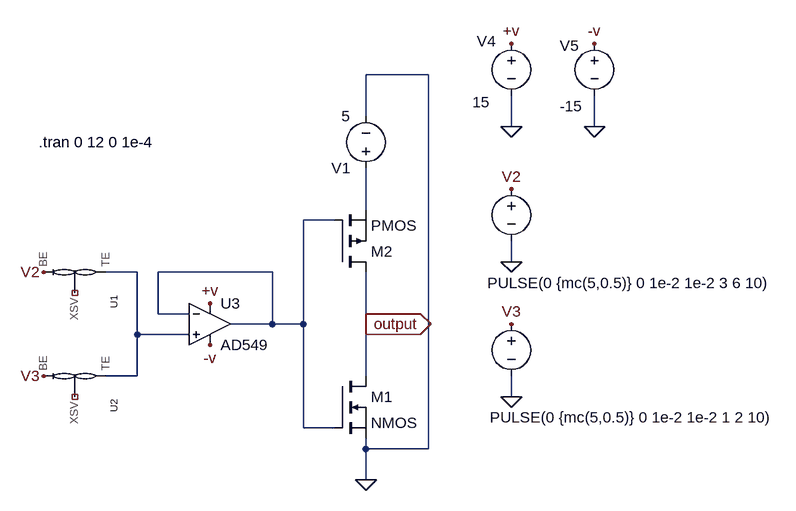
[diagram p0: schematic 与非门.asc]
与非门.asc, the LTspice schematic file:
Version 4
SHEET 1 1012 680
WIRE 448 -336 352 -336
WIRE 352 -272 352 -336
WIRE 576 -256 576 -304
WIRE 704 -256 704 -304
WIRE 352 -128 352 -192
WIRE 304 -112 256 -112
WIRE 576 -48 576 -80
WIRE 0 -32 -48 -32
WIRE 208 -32 32 -32
WIRE 32 32 32 -32
WIRE 80 32 32 32
WIRE 208 48 208 -32
WIRE 208 48 144 48
WIRE 256 48 256 -112
WIRE 256 48 208 48
WIRE 352 48 352 -32
WIRE 0 64 0 -32
WIRE 80 64 0 64
WIRE 0 128 0 64
WIRE 0 128 -48 128
WIRE 352 128 352 48
WIRE 576 160 576 128
WIRE 256 208 256 48
WIRE 304 208 256 208
WIRE 352 240 352 224
WIRE 448 240 448 -336
WIRE 448 240 352 240
WIRE 352 288 352 240
FLAG 576 -48 0
FLAG 352 288 0
FLAG 576 -256 0
FLAG 704 -256 0
FLAG 576 -384 +v
FLAG 704 -384 -v
FLAG 112 16 +v
FLAG 112 80 -v
FLAG 576 -160 V2
FLAG 576 48 V3
FLAG 576 160 0
FLAG -144 -32 V2
FLAG -144 128 V3
FLAG 352 48 output
IOPIN 352 48 Out
SYMBOL voltage 576 -176 R0
WINDOW 0 37 116 Invisible 2
WINDOW 3 183 176 Bottom 2
WINDOW 123 0 0 Left 0
WINDOW 39 0 0 Left 0
SYMATTR InstName V2
SYMATTR Value PULSE(0 {mc(5,0.5)} 0 1e-2 1e-2 3 6 10)
SYMBOL nmos 304 128 R0
SYMATTR InstName M1
SYMBOL pmos 304 -32 M180
SYMATTR InstName M2
SYMBOL voltage 352 -176 R180
WINDOW 123 0 0 Left 0
WINDOW 39 0 0 Left 0
SYMATTR InstName V1
SYMATTR Value 5
SYMBOL MEM_YAKOPCIC -96 -32 R90
SYMATTR InstName U1
SYMBOL MEM_YAKOPCIC -96 128 R90
SYMATTR InstName U2
SYMBOL OpAmps\\AD549 112 -16 R0
SYMATTR InstName U3
SYMBOL voltage 576 -400 R0
WINDOW 0 -53 12 Left 2
WINDOW 3 -60 106 Left 2
WINDOW 123 0 0 Left 0
WINDOW 39 0 0 Left 0
SYMATTR InstName V4
SYMATTR Value 15
SYMBOL voltage 704 -400 R0
WINDOW 0 -53 19 Left 2
WINDOW 3 -53 112 Left 2
WINDOW 123 0 0 Left 0
WINDOW 39 0 0 Left 0
SYMATTR InstName V5
SYMATTR Value -15
SYMBOL voltage 576 32 R0
WINDOW 0 37 116 Invisible 2
WINDOW 3 187 175 Bottom 2
WINDOW 123 0 0 Left 0
WINDOW 39 0 0 Left 0
SYMATTR InstName V6
SYMATTR Value PULSE(0 {mc(5,0.5)} 0 1e-2 1e-2 1 2 10)
TEXT -152 -232 Left 2 !.tran 0 12 0 1e-4

The netlist it stands for:
* 与非门.asc
V2 V2 0 PULSE(0 {mc(5,0.5)} 0 1e-2 1e-2 3 6 10)
M1 output N002 0 0 NMOS
M2 output N002 N001 N001 PMOS
V1 N001 0 5
XU1 N003 V2 NC_01 MEM_YAKOPCIC  ; pins TE BE XSV
XU2 N003 V3 NC_02 MEM_YAKOPCIC  ; pins TE BE XSV
XU3 N003 N002 +v -v N002 AD549  ; pins In+ In- V+ V- OUT
V4 +v 0 15
V5 -v 0 -15
V6 V3 0 PULSE(0 {mc(5,0.5)} 0 1e-2 1e-2 1 2 10)
.model NMOS NMOS
.model PMOS PMOS
.lib standard.mos
.tran 0 12 0 1e-4
.lib MEM_YAKOPCIC.sub
.backanno
.end